# EAGLE design Jeep_ECU (EAGLE 8.4.0)
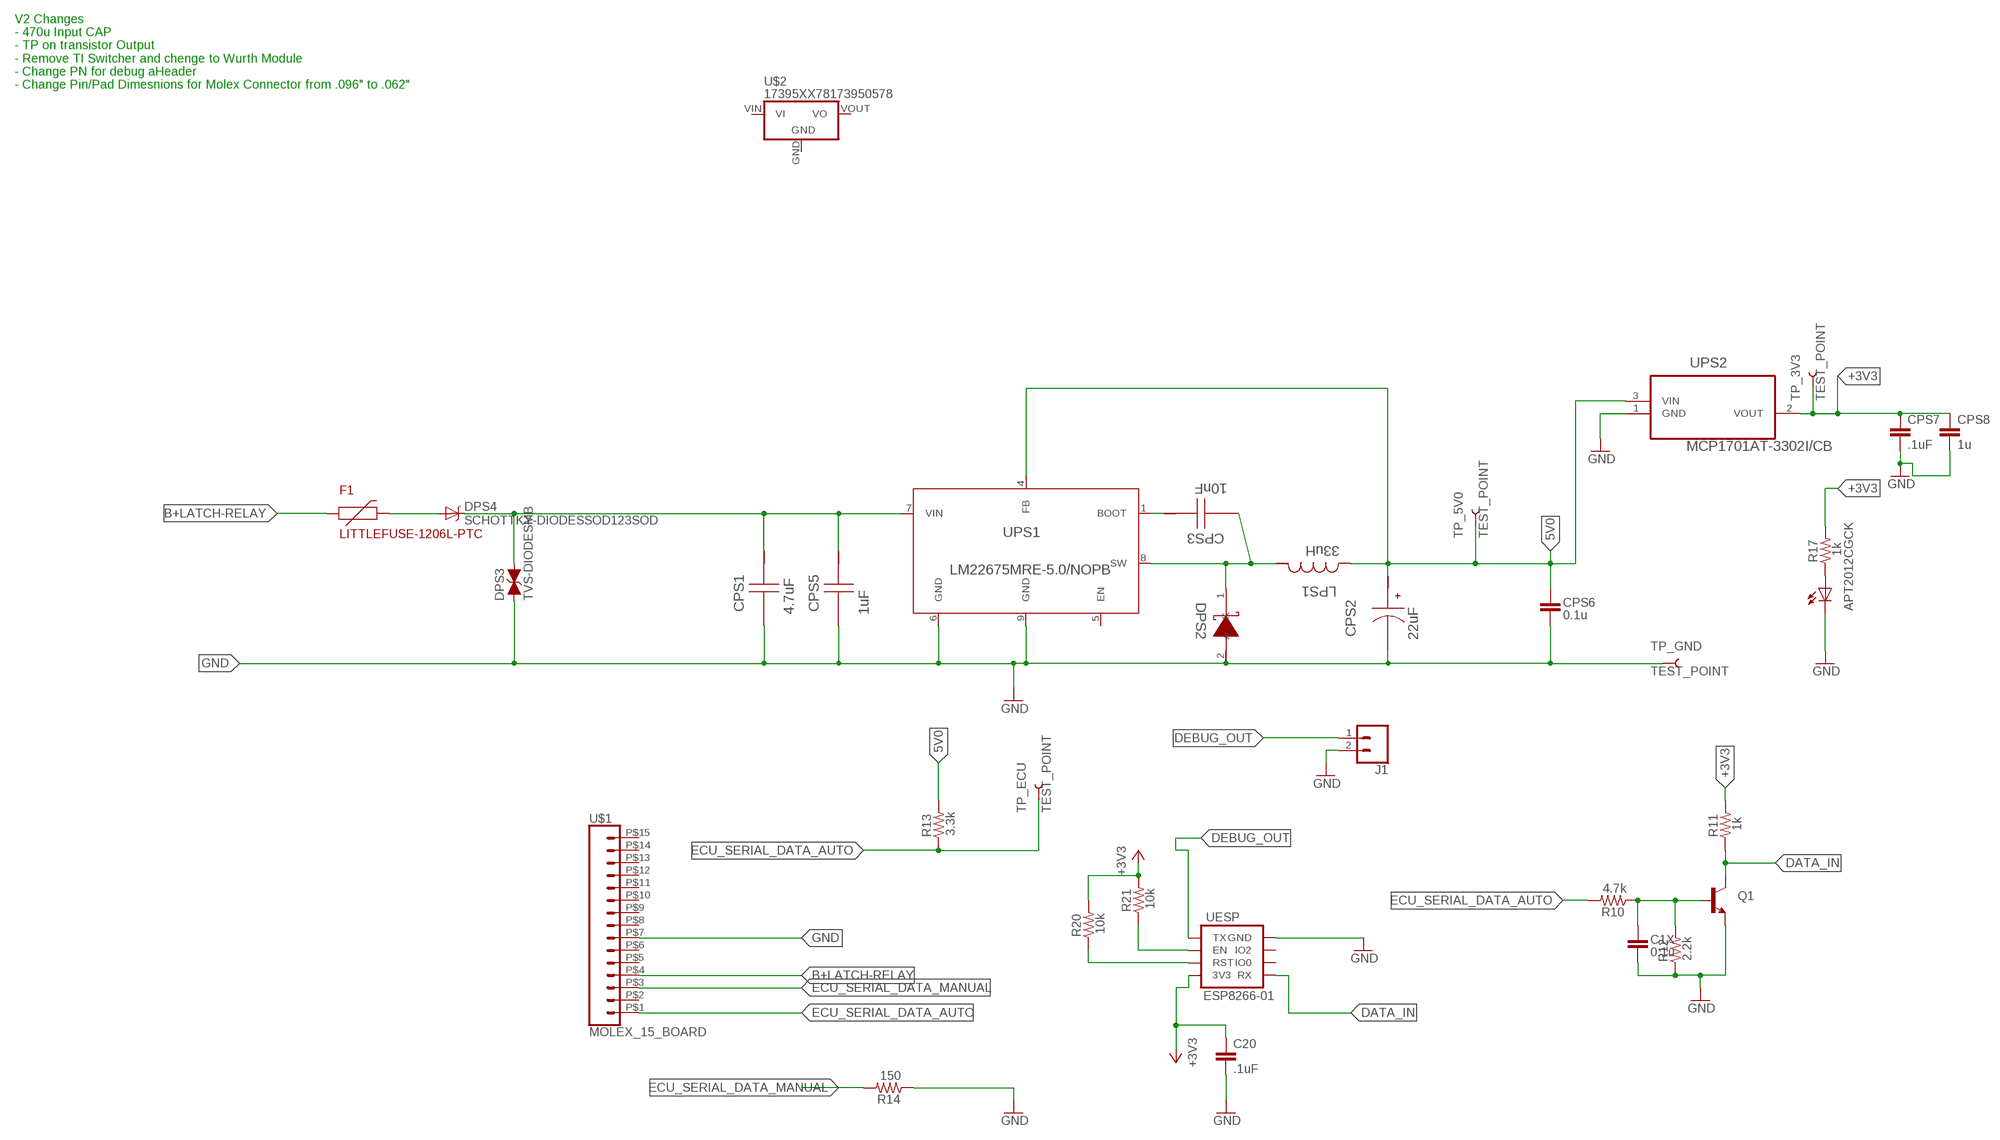
[diagram p0: schematic, sheet 1]

## Parts
C1X  0.1u  CAP0606-CAP  [0603-CAP]
C20  .1uF  CAP0606-CAP  [0603-CAP]
CPS1  4.7uF  C1608X5R1H105K080AB  [0603]
CPS2  22uF  8TPC22M  [CAPSMT_6_B1G]
CPS3  10nF  C0805C103K5RACTU  [0805]
CPS5  1uF  C1608X5R1H105K080AB  [0603]
CPS6  0.1u  CAP0606-CAP  [0603-CAP]
CPS7  .1uF  CAP0606-CAP  [0603-CAP]
CPS8  1u  CAP0606-CAP  [0603-CAP]
DPS2  SS26FL  [SOD-123F]
DPS3  TVS-DIODESMB  [SMB-DIODE]
DPS4  SCHOTTKY-DIODESSOD123SOD  [SOD-123F]
F1  LITTLEFUSE-1206L-PTC  [1206]
J1  CONN_02  [1X02]
LED_PWR  APT2012CGCK  LEDCHIP-LED0805  [CHIP-LED0805]
LPS1  33uH  SRN8040-330M  [SRN8040]
Q1  NPN-TRANSISTORMMBT3904-SOT23  [SOT23]
R10  4.7k  RESISTOR0603  [0603]
R11  1k  RESISTOR0603  [0603]
R12  2.2k  RESISTOR0603  [0603]
R13  3.3k  RESISTOR0603  [0603]
R14  150  RESISTOR0603  [0603]
R17  1k  RESISTOR0603  [0603]
R20  10k  RESISTOR0603  [0603]
R21  10k  RESISTOR0603  [0603]
TP_3V3  TEST_POINT  [TEST_POINT]
TP_5V0  TEST_POINT  [TEST_POINT]
TP_ECU  TEST_POINT  [TEST_POINT]
TP_GND  TEST_POINT  [TEST_POINT]
U$1  MOLEX_15_BOARD  [MOLEX_15PIN_BOARD]
U$2  17395XX78173950578  [17395XX78]
UESP  ESP8266-01  [ESP8266-01]
UPS1  LM22675MRE-5.0/NOPB  [MRA08B]
UPS2  MCP1701AT-3302I/CB  [SOT95P255X145-3N]

## Nets
5V0: CPS2.1(+) CPS6.1 LPS1.1 R13.2 TP_5V0.P$1 UPS1.4(FB) UPS2.3(VIN)
+3V3: C20.1 CPS7.1 CPS8.1 R11.2 R17.2 R20.2 R21.2 TP_3V3.P$1 UESP.2(3V3) UPS2.2(VOUT)
B+LATCH-RELAY: F1.1(P$1+) U$1.P$4
DATA_IN: Q1.3(C) R11.1 UESP.1(RX)
DEBUG_OUT: J1.1 UESP.8(TX)
ECU_SERIAL_DATA_AUTO: R10.2 R13.1 TP_ECU.P$1 U$1.P$1
ECU_SERIAL_DATA_MANUAL: R14.2 U$1.P$3
GND: C1X.2 C20.2 CPS1.2 CPS2.2(-) CPS5.2 CPS6.2 CPS7.2 CPS8.2 DPS2.2(A) DPS3.A J1.2 LED_PWR.C Q1.2(E) R12.1 R14.1 TP_GND.P$1 U$1.P$7 UESP.7(GND) UPS1.6(GND) UPS1.9(GND) UPS2.1(GND)
N$2: DPS4.A F1.2(P$2-)
N$3: R20.1 UESP.4(RST)
N$4: R21.1 UESP.6(EN)
N$7: C1X.1 Q1.1(B) R10.1 R12.2
N$35: LED_PWR.A R17.1
N$45: CPS3.1 UPS1.1(BOOT)
SW: CPS3.2 DPS2.1(K) LPS1.2 UPS1.8(SW)
VBR: CPS1.1 CPS5.1 DPS3.C DPS4.C UPS1.7(VIN)
Unconnected: U$1.P$2 U$1.P$5 U$1.P$6 U$1.P$8 U$1.P$9 U$1.P$10 U$1.P$11 U$1.P$12 U$1.P$13 U$1.P$14 U$1.P$15 U$2.GND(GND/ADJ) U$2.VIN(VI) U$2.VOUT(VO) UESP.3(IO0) UESP.5(IO2) UPS1.5(EN)

## Notes on the sheet
- V2 Changes
  - 470u Input CAP
  - TP on transistor Output
  - Remove TI Switcher and chenge to Wurth Module
  - Change PN for debug aHeader
  - Change Pin/Pad Dimesnions for Molex Connector from .096" to .062"

## Library data of the parts
C1X C20 CPS6 CPS7 = Eberle:CAP; MFG: Vishay; PN: VJ0603Y104JXJCW1BC; VDC: 16
CPS1 = TIRegLBR3:C1608X5R1H105K080AB; MFG: TDK; PN: C1608X5R1V475K080AC; VDC: 35
CPS2 = TIRegLBR3:8TPC22M; CAP: 2.2E5; DATASHEETURL: %20; ESR: 0.07; IRMS: 1.0; MANUFACTURER_NAME: Panasonic; MANUFACTURER_PART_NUMBER: 8TPC22M; MFG: Panasonic; PN: 8TPC22M; VDC: 8.0; VENDOR: Panasonic
CPS3 = TIRegLBR3:C0805C103K5RACTU; CAP: 1.0E8; ESR: 1.739; IRMS: 0.411; MANUFACTURER_NAME: Kemet; MANUFACTURER_PART_NUMBER: C0805C103K5RACTU; MFG: KEMET; PN: C0805C103K5RACTU; VDC: 50.0; VENDOR: Kemet
CPS5 = TIRegLBR3:C1608X5R1H105K080AB; CAP: 1.0E6; DATASHEETURL: httpsproduct.tdk.comensearchcapacitorceramicmlccinfo?part%5Fno%3DC1608X5R1H105K080AB; ESR: 0.005522; IRMS: 2.21617; MANUFACTURER_NAME: TDK; MANUFACTURER_PART_NUMBER: C1608X5R1H105K080AB; MFG: Yago; PN: CC0603KRX5R9BB105; VDC: 50.0; VENDOR: TDK
CPS8 = Eberle:CAP; MFG: Kemet; PN: C0603C105K4RACTU; VDC: 16
DPS2 = TIRegLBR3:SS26FL; DATASHEETURL: httpswww.fairchildsemi.comdatasheetsSSSS24FL.pdf; IO: 2.0; MANUFACTURER_NAME: Fairchild Semiconductor; MANUFACTURER_PART_NUMBER: SS26FL; MFG: ON Semi; PN: SS26FL; VENDOR: Fairchild Semiconductor; VFATIO: 0.7; VRRM: 60.0
DPS3 = Eberle:TVS-DIODE: TVS Diode; MFG: Littlefuse; PN: SZP6SMB43CAT3G
DPS4 = Eberle:SCHOTTKY-DIODES: SS24FL Schotkey Diode in SOD-123F package; MFG: Fairchild; PN: SS24FL
F1 = Eberle:LITTLEFUSE-1206L-PTC: LITTLEFUSE 1206L SERIES PTC; MFG: Littlefuse; PN: 1206L025YR; VAL: .25A Hold/.5A trip 16V
J1 = SparkFun-Connectors:CONN_02: Multi connection point. Often used as Generic Header-pin footprint for 0.1 inch spaced/style header connections On any of the 0.1 inch spaced packages, you can populate with these: Break Away Headers - Straight <https://www.sparkfun.com/products/116> (PRT-00116) Break Away Male Headers - Right Angle <https://www.sparkfun.com/products/553> (PRT-00553) Female Headers <https://www.sparkfun.com/products/115> (PRT-00115) Break Away Headers - Machine Pin <https://www.sparkfun.com/products/117> (PRT-00117) Break Away Female Headers - Swiss Machine Pin <https://www.sparkfun.com/products/743> (PRT-00743) For SCREWTERMINALS and SPRING TERMINALS visit here: Screw Terimnals on SparkFun.com <https://www.sparkfun.com/search/results?term=Screw+Terminals> (5mm/3.5mm/2.54mm spacing) This device is also useful as a general connection point to wire up your design to another part of your project. Our various solder wires solder well into these plated through hole pads. Hook-Up Wire - Assortment (Stranded, 22 AWG) <https://www.sparkfun.com/products/11375> (PRT-11375) Hook-Up Wire - Assortment (Solid Core, 22 AWG) <https://www.sparkfun.com/products/11367> (PRT-11367) View the entire wire category on our website here <https://www.sparkfun.com/categories/141> Special notes: Molex polarized connector foot print use with: PRT-08233 with associated crimp pins and housings. 2.54_SCREWTERM for use with PRT-10571. 3.5mm Screw Terminal footprints for PRT-08084 5mm Screw Terminal footprints for use with PRT-08432; MFG: 3M; PN: 929870-01-02-RA
LED_PWR = led:LED: LED OSRAM: - CHIPLED LG R971, LG N971, LY N971, LG Q971, LY Q971, LO R971, LY R971 LH N974, LH R974 LS Q976, LO Q976, LY Q976 LO Q996 - Hyper CHIPLED LW Q18S LB Q993, LB Q99A, LB R99A - SideLED LS A670, LO A670, LY A670, LG A670, LP A670 LB A673, LV A673, LT A673, LW A673 LH A674 LY A675 LS A676, LA A676, LO A676, LY A676, LW A676 LS A679, LY A679, LG A679 - Hyper Micro SIDELED® LS Y876, LA Y876, LO Y876, LY Y876 LT Y87S - SmartLED LW L88C, LW L88S LB L89C, LB L89S, LG L890 LS L89K, LO L89K, LY L89K LS L896, LA L896, LO L896, LY L896 - TOPLED LS T670, LO T670, LY T670, LG T670, LP T670 LSG T670, LSP T670, LSY T670, LOP T670, LYG T670 LG T671, LOG T671, LSG T671 LB T673, LV T673, LT T673, LW T673 LH T674 LS T676, LA T676, LO T676, LY T676, LB T676, LH T676, LSB T676, LW T676 LB T67C, LV T67C, LT T67C, LS T67K, LO T67K, LY T67K, LW E67C LS E67B, LA E67B, LO E67B, LY E67B, LB E67C, LV E67C, LT E67C LW T67C LS T679, LY T679, LG T679 LS T770, LO T770, LY T770, LG T770, LP T770 LB T773, LV T773, LT T773, LW T773 LH T774 LS E675, LA E675, LY E675, LS T675 LS T776, LA T776, LO T776, LY T776, LB T776 LHGB T686 LT T68C, LB T68C - Hyper Mini TOPLED® LB M676 - Mini TOPLED Santana® LG M470 LS M47K, LO M47K, LY M47K Source: http://www.osram.convergy.de LUXEON: - LUMILED® LXK2-PW12-R00, LXK2-PW12-S00, LXK2-PW14-U00, LXK2-PW14-V00 LXK2-PM12-R00, LXK2-PM12-S00, LXK2-PM14-U00 LXK2-PE12-Q00, LXK2-PE12-R00, LXK2-PE12-S00, LXK2-PE14-T00, LXK2-PE14-U00 LXK2-PB12-K00, LXK2-PB12-L00, LXK2-PB12-M00, LXK2-PB14-N00, LXK2-PB14-P00, LXK2-PB14-Q00 LXK2-PR12-L00, LXK2-PR12-M00, LXK2-PR14-Q00, LXK2-PR14-R00 LXK2-PD12-Q00, LXK2-PD12-R00, LXK2-PD12-S00 LXK2-PH12-R00, LXK2-PH12-S00 LXK2-PL12-P00, LXK2-PL12-Q00, LXK2-PL12-R00 Source: www.luxeon.com KINGBRIGHT: KA-3528ASYC Source: www.kingbright.com; MFG: Kingbright; PN: APT2012CGCK
LPS1 = TIRegLBR3:SRN8040-330M; DATASHEETURL: httpwww.bourns.comdataglobalpdfsSRN8040.pdf; DCR: 0.145; IDC: 1.7; L: 3.3E5; MANUFACTURER_NAME: Bourns; MANUFACTURER_PART_NUMBER: SRN8040330M; MFG: Bourns; PN: SRN8040-330M; VENDOR: Bourns
Q1 = Eberle:NPN-TRANSISTOR; MFG: On Semiconductor; PN: MMBT3904LT1G
R10 = SparkFun-Resistors:RESISTOR: Generic Resistor Package; MFG: Panasonic; PN: ERJ-3GEYJ472V
R11 R17 = SparkFun-Resistors:RESISTOR: Generic Resistor Package; MFG: Panasonic; PN: ERJ-3GEYJ102V
R12 = SparkFun-Resistors:RESISTOR: Generic Resistor Package; MFG: Panasonic; PN: ERJ-3GEYJ222V
R13 = SparkFun-Resistors:RESISTOR: Generic Resistor Package; MFG: Panasonic; PN: ERJ-3GEYJ332V
R14 = SparkFun-Resistors:RESISTOR: Generic Resistor Package; MFG: Panasonic; PN: ERJ-3GEYJ151V
R20 R21 = SparkFun-Resistors:RESISTOR: Generic Resistor Package; MFG: Panasonic; PN: ERJ-3GEYJ103V
TP_3V3 TP_5V0 TP_ECU TP_GND = Eberle:TEST_POINT: Test Point; MFG: Harwin; PN: S1751-46
U$1 = Eberle:MOLEX_15_BOARD: PCB Board that Accepts .093" Male Pins in place of Molex Connectore. JEEP ECU Interface
U$2 = Eberle:17395XX78: Wurth Electronics Power Modules: 17395xx78 Offer 5V and 3.3V All in one switching regulator up to 0.5A
UESP = Eberle:ESP8266-01: ESP8266-01 WiFi Module; MFG: 3M; PN: 929852-01-04-RB
UPS1 = TIRegLBR3:LM22675MRE-5.0/NOPB; MFG: TI; PN: LM2675MX-3.3/NOPB
UPS2 = Microchip_By_element14_Batch_1:MCP1701AT-3302I/CB: IC, LDO REG, 250MA, 3.3V; MFG: Microchip; MPN: MCP1701AT-3302I/CB; OC_FARNELL: 1605554; OC_NEWARK: 11N7985; PACKAGE: SOT-23; PN: MCP1701AT-3302I/CB; SUPPLIER: MICROCHIP

## Net classes
0 default: width 0.33 mm

## Board
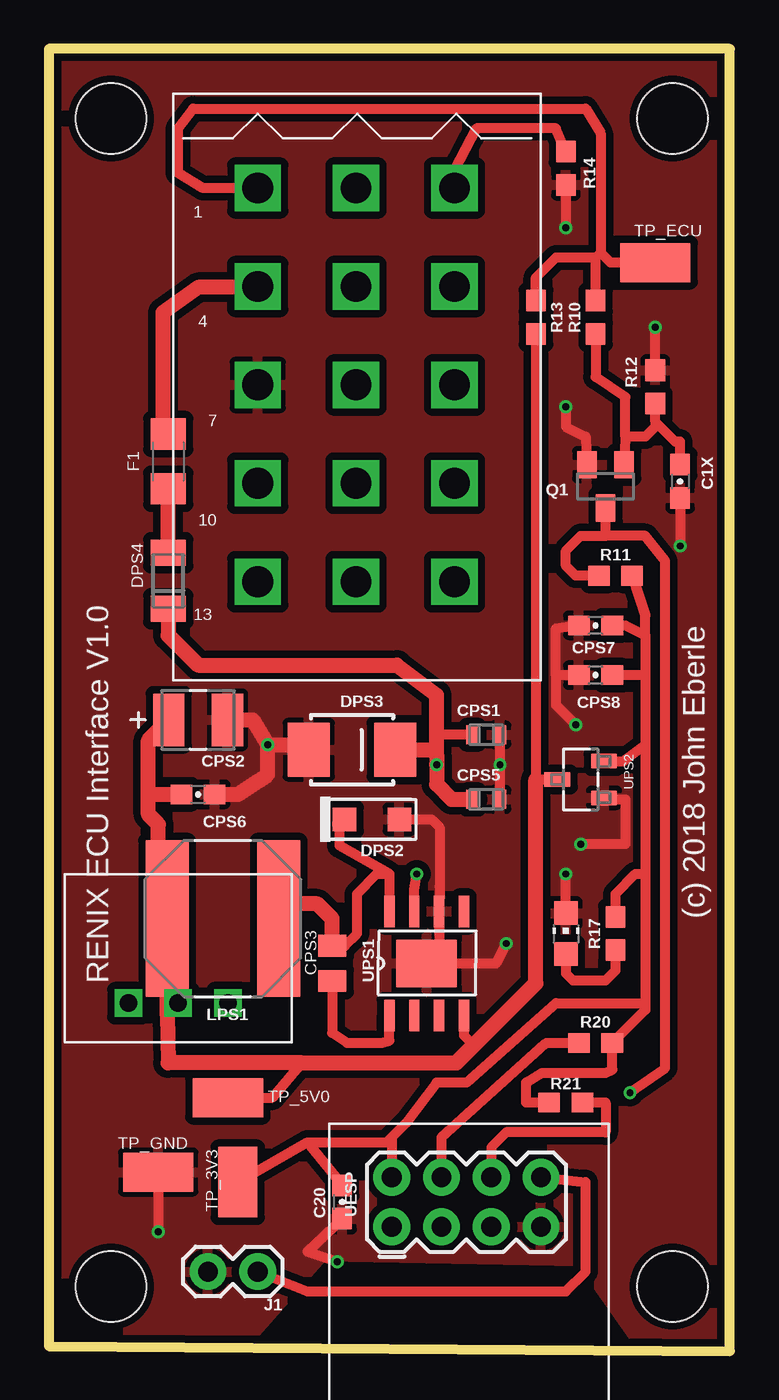
[diagram p1: board, top side]
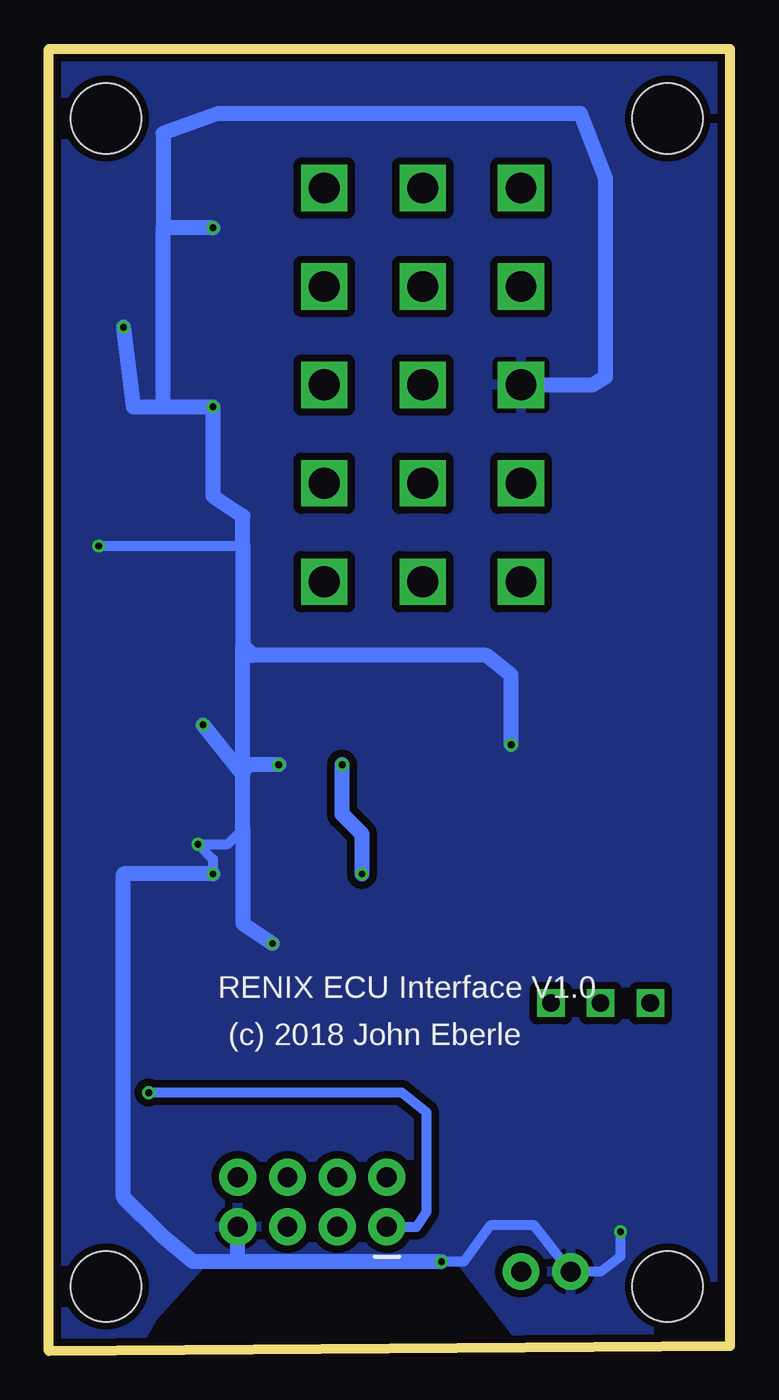
[diagram p2: board, bottom side, seen from below]

Size 34.8 x 66.55 mm. Coordinates in mm from the lower left corner, seen from the top.
Outline: 0,66.55 0,0.25 34.8,0 34.8,66.55 0,66.55
Copper layers (1*16): Top 0.035mm / dielectric 1.5mm / Bottom 0.035mm
Design rules "SeeedStudio_2layer_DRU_no_angle_20140221": minimum track width 6mil, minimum drill 12mil, track to track 6mil, track to pad 6mil, pad to pad 6mil, via to via 6mil, smd to smd 0mil, copper to edge 10mil, drill to drill 10mil, minimum pad ring 10mil, minimum via ring 6mil, stop-mask expansion 2mil, vias tented up to drill 100mil, thermal gap 10mil
Holes 3.6 mm at 3.17,3.3 31.88,3.3 3.17,62.99 31.88,62.99

### Footprints (pad centres in the part's own frame; a part is rotated, then mirrored left to right if it is on the bottom)
0603-CAP = smd 1.1 x 1: 1 -0.85,0; 2 0.85,0
0603 = smd 0.66 x 0.965: 1 -0.699,0; 2 0.699,0
CAPSMT_6_B1G = smd 1.6 x 2.692: 1 -1.499,0; 2 1.499,0
0805 = smd 1.118 x 1.448: 1 -0.902,0; 2 0.902,0
SOD-123F = smd 1.2 x 1.2: 1 -1.4,0; 2 1.4,0
SMB-DIODE = smd 2.159 x 2.743: A -2.211,0; C 2.211,0
SOD-123F' = smd 1.34 x 1.8: A 1.43,0; C -1.43,0
1206 = smd 1.6 x 1.8: 1 -1.4,0; 2 1.4,0
1X02 = drill 1.016 pad 1.88: 1 0,0; 2 2.54,0
CHIP-LED0805 = smd 1.2 x 1.2: A 0,-1.05; C 0,1.05
SRN8040 = smd 2.2 x 8: 1 -2.85,0; 2 2.85,0
SOT23 = smd 1 x 1.4: 1 -0.95,-1.1; 2 0.95,-1.1; 3 0,1.1
0603' = smd 1.1 x 1: 1 -0.85,0; 2 0.85,0
TEST_POINT = smd 2 x 3.6: P$1 0,0
MOLEX_15PIN_BOARD = drill 1.575 square: P$1 -5.08,10.16; P$2 -0.051,10.16; P$3 4.978,10.16; P$4 -5.08,5.131; P$5 -0.051,5.131; P$6 4.978,5.131; P$7 -5.08,0.102; P$8 -0.051,0.102; P$9 4.978,0.102; P$10 -5.08,-4.928; P$11 -0.051,-4.928; P$12 4.978,-4.928; P$13 -5.08,-9.957; P$14 -0.051,-9.957; P$15 4.978,-9.957
17395XX78 = drill 0.9 square: GND 0,0; VIN -2.54,0; VOUT 2.54,0
ESP8266-01 = drill 1.016 pad 1.88: 1 -3.81,-1.27; 2 -3.81,1.27; 3 -1.27,-1.27; 4 -1.27,1.27; 5 1.27,-1.27; 6 1.27,1.27; 7 3.81,-1.27; 8 3.81,1.27
MRA08B = smd 1.6 x 0.533: 1 -2.654,1.905; 2 -2.654,0.635; 3 -2.654,-0.635; 4 -2.654,-1.905; 5 2.654,-1.905; 6 2.654,-0.635; 7 2.654,0.635; 8 2.654,1.905 | smd 2.413 x 3.099: 9 0,0
SOT95P255X145-3N = smd 0.75 x 1.321: 1 -0.94,-1.194; 2 0.94,-1.194; 3 0,1.194

### Placement (x,y rotation side)
C1X  32.26,44.45 270 top
C20  14.99,7.62 270 top
CPS1  22.35,31.5 0 top
CPS2  7.62,32.26 0 top
CPS3  14.48,19.81 90 top
CPS5  22.35,28.19 0 top
CPS6  7.62,28.45 0 top
CPS7  27.94,37.08 180 top
CPS8  27.94,34.54 180 top
DPS2  16.51,27.18 0 top
DPS3  15.49,30.73 0 top
DPS4  SCHOTTKY-DIODESSOD123SOD  [SOD-123F']  6.1,39.37 90 top
F1  6.1,45.47 270 top
J1  10.67,4.06 180 top
LED_PWR  26.42,21.34 0 top
LPS1  8.89,22.1 0 top
Q1  28.45,44.2 180 top
R10  4.7k  [0603']  27.94,52.83 90 top
R11  1k  [0603']  28.96,39.62 0 top
R12  2.2k  [0603']  30.99,49.28 270 top
R13  3.3k  [0603']  24.89,52.83 270 top
R14  150  [0603']  26.42,60.45 90 top
R17  1k  [0603']  28.96,21.34 90 top
R20  10k  [0603']  27.94,15.75 0 top
R21  10k  [0603']  26.42,12.7 180 top
TP_3V3  9.65,8.64 0 top
TP_5V0  9.14,12.95 90 top
TP_ECU  30.99,55.63 270 top
TP_GND  5.59,9.14 90 top
U$1  15.75,49.28 0 top
U$2  6.6,17.78 0 top
UESP  21.34,7.62 0 top
UPS1  19.3,19.81 90 top
UPS2  27.18,29.21 90 top

### Tracks (layer width: path | path; a pad name or v marks a point on that pad's centre or on a via)
5V0
  Top 0.508: UPS1.4 21.21,16.12 21.59,15.75 21.84,15.75 | R13.2 24.89,29.21 UPS2.3 | TP_5V0.P$1 11.43,12.95 12.95,14.73
  Top 0.762: LPS1.1 6.04,17.22 6.1,14.73 12.95,14.73 20.83,14.73 21.84,15.75 24.89,18.8 24.89,29.21 | 5.08,28.45 CPS6.1 | 5.08,28.45 5.08,31.22 CPS2.1 | 5.59,22.55 5.59,26.92 5.08,27.43 5.08,28.45
  Top 0.813: LPS1.1 5.59,22.55
+3V3
  Top 0.508: 30.48,34.54 CPS8.1 | 30.48,34.54 30.48,30.99 | 30.48,30.99 29.46,30.23 29.39,30.15 UPS2.2 | CPS7.1 29.46,37.08 30.48,36.58 | 17.53,10.92 UESP.2 | 17.53,10.92 17.27,10.67 13.21,10.67 | 13.21,10.67 C20.1 | R21.2 24.38,12.7 24.38,13.72 25.22,14.22 28.45,14.22 28.79,14.39 R20.2 30.48,17.44 30.48,17.78 | 30.48,24.38 30.48,17.78 | R17.2 28.96,23.37 29.97,24.38 30.48,24.38 | TP_3V3.P$1 13.21,10.67 | R11.2 30.48,37.59 30.48,36.58 | 30.48,17.78 25.91,17.78 21.34,13.72 19.81,13.72 18.29,11.68 17.53,10.92 | 30.48,36.58 30.48,34.54 | 30.48,30.99 30.48,24.38
B+LATCH-RELAY
  Top 0.508: U$1.P$4 10.62,54.36
  Top 0.762: 10.62,54.36 7.62,54.36 5.84,53.09 5.84,47.12 F1.1
DATA_IN  (via drill 0.35)
  Top 0.508: 28.45,41.66 Q1.3 | 28.45,41.66 30.48,41.66 31.5,40.39 31.5,14.46 v29.7,13.21 | 28.45,41.66 27.18,41.66 26.42,40.89 26.42,40.13 26.92,39.62 R11.1
  Bottom 0.508: UESP.1 16,6.35 15.49,7.11 15.49,12.19 16.76,13.21 v29.7,13.21
DEBUG_OUT
  Top 0.508: UESP.8 27.43,8.64 27.43,4.06 26.42,3.05 13.21,3.05 J1.1
ECU_SERIAL_DATA_AUTO
  Top 0.508: U$1.P$1 7.87,59.44 6.6,60.2 6.6,62.48 7.37,63.5 27.43,63.5 28.19,62.23 28.19,56.13 | R13.1 24.89,54.86 25.91,55.88 27.94,55.88 | R10.2 27.94,55.88 | 28.19,56.13 27.94,55.88 | TP_ECU.P$1 28.7,55.63 28.19,56.13
ECU_SERIAL_DATA_MANUAL
  Top 0.508: U$1.P$3 20.73,60.35 21.84,62.48 25.91,62.48 R14.2
GND  (via drill 0.35)
  Top 0.508: R14.1 v26.42,57.4 | DPS3.A 13.54,30.99 | v23.37,20.83 22.86,19.81 UPS1.9 19.94,19.94 UPS1.6 19.97,23.74 19.97,26.77 19.56,27.18 DPS2.2 | CPS1.2 v23.05,29.97 CPS5.2 | v26.42,48.26 26.42,47.24 27.43,46.74 Q1.2 | R12.1 v30.99,52.32 | v27.18,25.91 29.46,25.91 29.46,28.19 28.45,28.19 UPS2.1 | C20.2 13.21,5.08 v14.73,4.57 | LED_PWR.C v26.42,24.38 | TP_GND.P$1 v5.59,6.1 | CPS7.2 25.91,36.92 25.91,34.54 | 25.91,34.54 25.91,33.02 v26.92,32 | CPS8.2 25.91,34.54 | C1X.2 v32.26,41.15
  Top 0.762: v11.18,30.99 13.54,30.99 | CPS6.2 9.65,28.45 11.18,29.46 v11.18,30.99 | CPS2.2 10.41,32.26 v11.18,30.99
  Bottom 0.508: v5.59,6.1 5.59,4.83 6.6,4.06 J1.2 9.98,6.43 12.24,6.43 13.59,4.57 v14.73,4.57 | 24.38,29.97 24.89,29.46 | v26.42,24.38 26.42,25.15 v27.18,25.91 25.65,25.91 24.89,26.67 | v32.26,41.15 24.89,41.15
  Bottom 0.762: U$1.P$7 7.01,49.38 6.35,49.78 6.35,59.94 7.62,63.25 26.16,63.25 28.96,62.23 28.96,57.4 | v26.42,57.4 28.96,57.4 | v11.18,30.99 11.18,34.54 12.45,35.56 24.38,35.56 24.89,36.07 | 24.89,36.07 24.89,41.15 24.89,42.67 26.42,43.69 v26.42,48.26 28.96,48.26 | v23.05,29.97 24.38,29.97 | 25.15,4.57 UESP.7 | 25.15,4.57 27.43,4.57 28.96,5.84 30.99,7.87 30.99,24.38 v26.42,24.38 | v14.73,4.57 25.15,4.57 | 28.96,48.26 28.96,57.4 | v23.37,20.83 24.89,21.84 24.89,26.67 24.89,29.46 | 24.89,29.46 24.89,36.07 | v26.92,32 24.89,29.46 | v30.99,52.32 30.48,48.26 28.96,48.26
  pour Bottom (isolate 0.381): 0,0 0,66.55 34.8,66.55 34.8,0 30.48,0 29.46,1.78 26.92,4.57 13.72,4.57 10.41,0.25
  pour Top (isolate 0.381): 0,66.55 34.8,66.55 34.8,0 30.23,0.25 27.18,4.57 13.97,4.83 10.16,0.51 0,0.25
N$2
  Top 0.762: DPS4.A F1.2
N$3
  Top 0.508: UESP.4 20.07,10.92 25.35,15.7 25.42,15.75 R20.1
N$4
  Top 0.508: UESP.6 22.61,10.41 23.37,11.18 28.45,11.18 28.45,12.7 R21.1
N$7
  Top 0.508: R10.1 27.94,49.78 29.46,48.77 29.46,46.74 | 29.46,46.74 Q1.1 | 30.99,47.5 R12.2 | 30.99,47.5 30.99,47.24 30.48,46.74 29.46,46.74 | C1X.1 32.26,46.48 32,46.48 30.99,47.5
N$35
  Top 0.508: LED_PWR.A 26.42,19.3 26.77,18.95 28.45,18.95 28.96,19.46 R17.1
N$45
  Top 0.508: CPS3.1 14.48,16.26 15.24,15.75 17.02,15.75 17.4,15.86 UPS1.1
SW
  Top 0.508: CPS3.2 15.13,20.71 15.75,21.34 15.75,23.37 16.76,24.38 17.4,24.38 | LPS1.2 11.23,19.87 11.68,20.83 | 17.4,24.38 UPS1.8 | 17.4,24.38 14.86,25.84 14.86,26.93
  Top 0.762: CPS3.2 14.48,22.1 13.72,22.86 11.18,22.86 11.18,22.66 LPS1.2 | 14.86,26.93 DPS2.1
VBR  (via drill 0.35)
  Top 0.508: 17.94,31.52 DPS3.C | UPS1.7 18.67,23.58 v18.8,24.38 | CPS1.1 19.81,31.5
  Top 0.762: DPS4.C 6.1,36.58 7.62,35.05 17.78,35.05 19.81,33.53 19.81,31.5 19.81,30.48 | 19.81,30.48 v19.81,29.97 19.81,28.96 20.57,28.19 CPS5.1 | DPS3.C 19.56,30.73 19.81,30.48
  Bottom 0.762: v18.8,24.38 18.8,26.42 19.81,27.43 v19.81,29.97

### Text on the board
tPlace: (c) 2018 John Eberle | RENIX ECU Interface V1.0
bPlace: RENIX ECU Interface V1.0 | (c) 2018 John Eberle
tNames: 1 | 4 | 7 | 10 | 13